# EAGLE schematic power mux-fpf1320 (EAGLE 6.5.0)
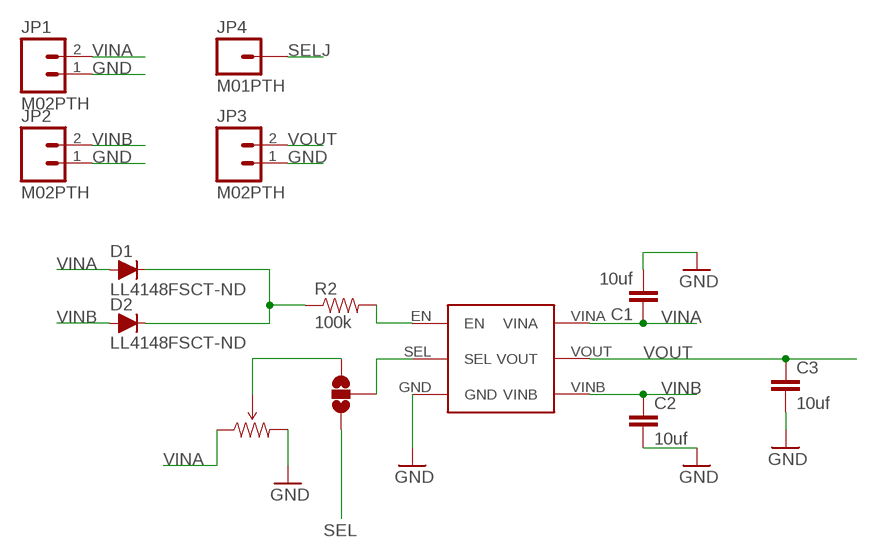
[diagram p0: schematic, sheet 1]

## Parts
C1  10uf  CAP0805  [0805]
C2  10uf  CAP0805  [0805]
C3  10uf  CAP0805  [0805]
D1  LL4148FSCT-ND  D-FILL-SOD-80  [SOD80]
D2  LL4148FSCT-ND  D-FILL-SOD-80  [SOD80]
JP1  M02PTH  [1X02]
JP2  M02PTH  [1X02]
JP3  M02PTH  [1X02]
JP4  M01PTH  [1X01]
R1  TRIMPOT-PTH-KNOB  [3386U]
R2  100k  RESISTOR0805-RES  [0805]
SJ2  SOLDERJUMPER_2WAYPASTE1&2  [SJ_3_PASTE1&2]
U$3  FPF1320  [6-UFBGA]

## Nets
GND: C1.2 C2.2 C3.2 JP1.1 JP2.1 JP3.1 R1.3(CW) U$3.GND
N$1: D1.1(C) D2.1(C) R2.1
N$2: R2.2 U$3.EN
N$3: SJ2.2 U$3.SEL
SEL: R1.2(WIPER) SJ2.3
SELJ: JP4.1 SJ2.1
VINA: C1.1 D1.2(A) JP1.2 R1.1(CCW) U$3.VINA
VINB: C2.1 D2.2(A) JP2.2 U$3.VINB
VOUT: C3.1 JP3.2 U$3.VOUT

## Library data of the parts
C1-C3 = SparkFun-Capacitors:CAP: Capacitor Standard 0603 ceramic capacitor, and 0.1" leaded capacitor.
D1 D2 = semicon-smd-ipc:D-FILL-: DIODE filled
JP1-JP3 = SparkFun-Connectors:M02: Standard 2-pin 0.1" header. Use with - straight break away headers ( PRT-00116) - right angle break away headers (PRT-00553) - swiss pins (PRT-00743) - machine pins (PRT-00117) - female headers (PRT-00115) Molex polarized connector foot print use with: PRT-08233 with associated crimp pins and housings. 2.54_SCREWTERM for use with PRT-10571. 3.5mm Screw Terminal footprints for PRT-08084 5mm Screw Terminal footprints for use with PRT-08433
JP4 = SparkFun-Connectors:M01: Header 1 Standard 1-pin 0.1" header. Use with straight break away headers (SKU : PRT-00116), right angle break away headers (PRT-00553), swiss pins (PRT-00743), machine pins (PRT-00117), and female headers (PRT-00115).
R1 = SparkFun-Electromechanical:TRIMPOT: Various small potentiometers for "set-and-forget" applications
R2 = SparkFun-Passives:RESISTOR: Resistor Basic schematic elements and footprints for 0603, 1206, and PTH resistors.
SJ2 = SparkFun-Passives:SOLDERJUMPER_2WAY: Solder Jumper 2 way solder jumper
U$3 = Richards:FPF1320